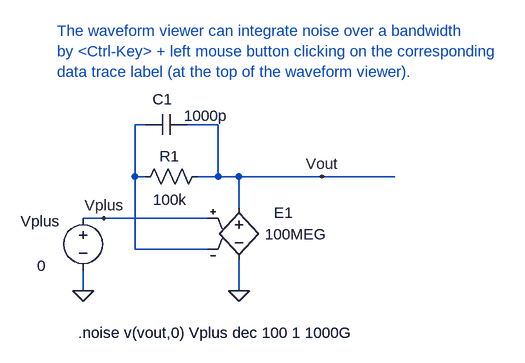
[diagram p0: schematic Ex8_18.asc]
Ex8_18.asc, the LTspice schematic file:
Version 4
SHEET 1 1084 704
WIRE 352 368 352 336
WIRE 384 256 352 256
WIRE 432 192 432 112
WIRE 432 304 432 192
WIRE 448 112 432 112
WIRE 448 192 432 192
WIRE 544 256 384 256
WIRE 544 304 432 304
WIRE 560 112 512 112
WIRE 560 192 528 192
WIRE 560 192 560 112
WIRE 592 192 560 192
WIRE 592 240 592 192
WIRE 592 368 592 320
WIRE 720 192 592 192
WIRE 832 192 720 192
FLAG 592 368 0
FLAG 352 368 0
FLAG 720 192 Vout
FLAG 384 256 Vplus
SYMBOL e 592 224 R0
WINDOW 0 54 24 Left 0
WINDOW 3 40 57 Left 0
SYMATTR InstName E1
SYMATTR Value 100MEG
SYMBOL voltage 352 240 R0
WINDOW 0 -96 21 Left 0
WINDOW 3 -71 89 Left 0
WINDOW 123 0 0 Left 0
WINDOW 39 0 0 Left 0
SYMATTR InstName Vplus
SYMATTR Value 0
SYMBOL res 432 208 R270
WINDOW 0 32 53 VTop 0
WINDOW 3 -4 54 VBottom 0
SYMATTR InstName R1
SYMATTR Value 100k
SYMBOL cap 448 128 R270
WINDOW 0 39 26 VTop 0
WINDOW 3 45 93 VBottom 0
SYMATTR InstName C1
SYMATTR Value 1000p
TEXT 344 432 Left 0 !.noise v(vout,0) Vplus dec 100 1 1000G
TEXT 312 -32 Left 0 ;The waveform viewer can integrate noise over a bandwidth \nby <Ctrl-Key> + left mouse button clicking on the corresponding \ndata trace label (at the top of the waveform viewer).

The netlist it stands for:
* Ex8_18.asc
E1 Vout 0 Vplus N001 100MEG
Vplus Vplus 0 0
R1 N001 Vout 100k
C1 N001 Vout 1000p
.noise v(vout,0) Vplus dec 100 1 1000G
* The waveform viewer can integrate noise over a bandwidth
* by <Ctrl-Key> + left mouse button clicking on the corresponding
* data trace label (at the top of the waveform viewer).
.backanno
.end